# EAGLE design VUSB Protoboard (EAGLE 6.1)
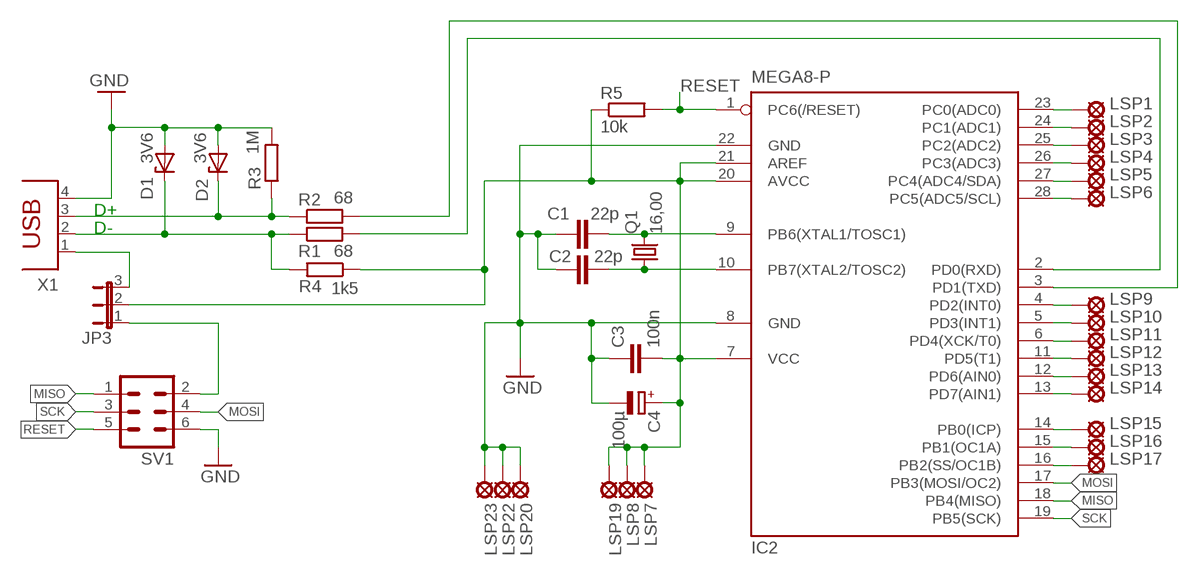
[diagram p0: schematic, sheet 1]

## Parts
C1  22p  C-EU025-025X050  [C025-025X050]
C2  22p  C-EU025-025X050  [C025-025X050]
C3  100n  C-EU025-025X050  [C025-025X050]
C4  100µ  CPOL-EUE2.5-6  [E2,5-6]
D1  3V6  ZENER-DIODEZD-7.5  [ZDIO-7.5]
D2  3V6  ZENER-DIODEZD-7.5  [ZDIO-7.5]
IC2  MEGA8-P  [DIL28-3]
JP3  JP2E  [JP2]
LSP1  LSP11  [LSP11]
LSP2  LSP11  [LSP11]
LSP3  LSP11  [LSP11]
LSP4  LSP11  [LSP11]
LSP5  LSP11  [LSP11]
LSP6  LSP11  [LSP11]
LSP7  LSP11  [LSP11]
LSP8  LSP11  [LSP11]
LSP9  LSP11  [LSP11]
LSP10  LSP11  [LSP11]
LSP11  LSP11  [LSP11]
LSP12  LSP11  [LSP11]
LSP13  LSP11  [LSP11]
LSP14  LSP11  [LSP11]
LSP15  LSP11  [LSP11]
LSP16  LSP11  [LSP11]
LSP17  LSP11  [LSP11]
LSP19  LSP11  [LSP11]
LSP20  LSP11  [LSP11]
LSP22  LSP11  [LSP11]
LSP23  LSP11  [LSP11]
Q1  16,00  CRYSTALHC49S  [HC49/S]
R1  68  R-EU_0207/10  [0207/10]
R2  68  R-EU_0207/10  [0207/10]
R3  1M  R-EU_0207/10  [0207/10]
R4  1k5  R-EU_0207/10  [0207/10]
R5  10k  R-EU_0207/10  [0207/10]
SV1  ML6  [ML6]
X1  PN61729  [PN61729]

## Nets
D+: D2.C R2.1 R3.1 X1.3
D-: D1.C R1.1 R4.2 X1.2
GND: C1.1 C2.1 C3.1 C4.- D1.A D2.A IC2.8(GND) IC2.22(GND) LSP20.MP LSP22.MP LSP23.MP R3.2 SV1.6 X1.4
ISPVCC: JP3.1 SV1.2
MISO: IC2.18(PB4(MISO)) SV1.1
MOSI: IC2.17(PB3(MOSI/OC2)) SV1.4
N$1: IC2.2(PD0(RXD)) R1.2
N$2: IC2.3(PD1(TXD)) R2.2
N$3: JP3.3 X1.1
N$4: IC2.16(PB2(SS/OC1B)) LSP17.MP
N$5: IC2.15(PB1(OC1A)) LSP16.MP
N$6: IC2.14(PB0(ICP)) LSP15.MP
N$7: IC2.13(PD7(AIN1)) LSP14.MP
N$8: IC2.12(PD6(AIN0)) LSP13.MP
N$9: C1.2 IC2.9(PB6(XTAL1/TOSC1)) Q1.2
N$10: C2.2 IC2.10(PB7(XTAL2/TOSC2)) Q1.1
N$11: IC2.11(PD5(T1)) LSP12.MP
N$12: IC2.6(PD4(XCK/T0)) LSP11.MP
N$13: IC2.5(PD3(INT1)) LSP10.MP
N$14: IC2.4(PD2(INT0)) LSP9.MP
N$15: IC2.23(PC0(ADC0)) LSP1.MP
N$16: IC2.24(PC1(ADC1)) LSP2.MP
N$17: IC2.25(PC2(ADC2)) LSP3.MP
N$18: IC2.26(PC3(ADC3)) LSP4.MP
N$19: IC2.27(PC4(ADC4/SDA)) LSP5.MP
N$20: IC2.28(PC5(ADC5/SCL)) LSP6.MP
RESET: IC2.1(PC6(/RESET)) R5.2 SV1.5
SCK: IC2.19(PB5(SCK)) SV1.3
VCC: C3.2 C4.+ IC2.7(VCC) IC2.20(AVCC) IC2.21(AREF) JP3.2 LSP7.MP LSP8.MP LSP19.MP R4.1 R5.1

## Notes on the sheet
- D+
- D-

## Library data of the parts
C1-C3 = resistor:C-EU: CAPACITOR, European symbol
C4 = resistor:CPOL-EU: POLARIZED CAPACITOR, European symbol
D1 D2 = diode:ZENER-DIODE: Z-Diode
IC2 = atmel:MEGA8-P: MICROCONTROLLER 8 Kbytes FLASH, 1 kbytes SRAM, 512 bytes EEPROM, USART, 4-channel 10 bit ADC, 2-channel 8 bit ADC Pin compatible with Atmega48, ATMega88, ATMega168 Source: avr.lbr; OC_FARNELL: unknown; OC_NEWARK: unknown
JP3 = jumper:JP2E: JUMPER
LSP1-LSP17 LSP19 LSP20 LSP22 LSP23 = solpad:LSP11: SOLDER PAD drill 1.1 mm
Q1 = crystal:CRYSTAL: CRYSTAL; OC_FARNELL: 1667008; OC_NEWARK: unknown
R1-R5 = resistor:R-EU_: RESISTOR, European symbol
SV1 = con-harting-ml:ML6: HARTING; OC_FARNELL: unknown; OC_NEWARK: unknown
X1 = con-berg:PN61729: BERG USB connector; OC_FARNELL: unknown; OC_NEWARK: unknown

## Board
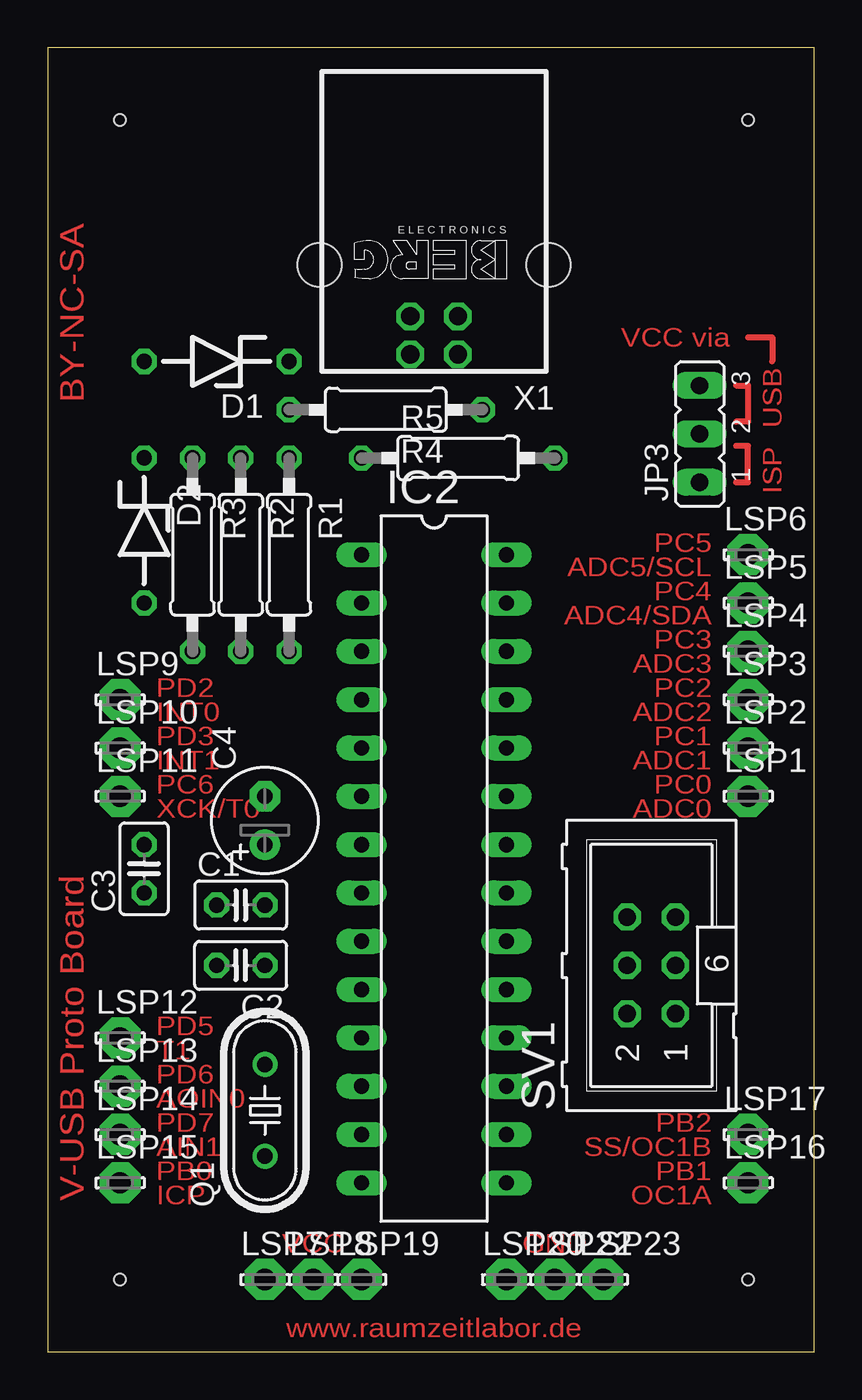
[diagram p1: board, top side]
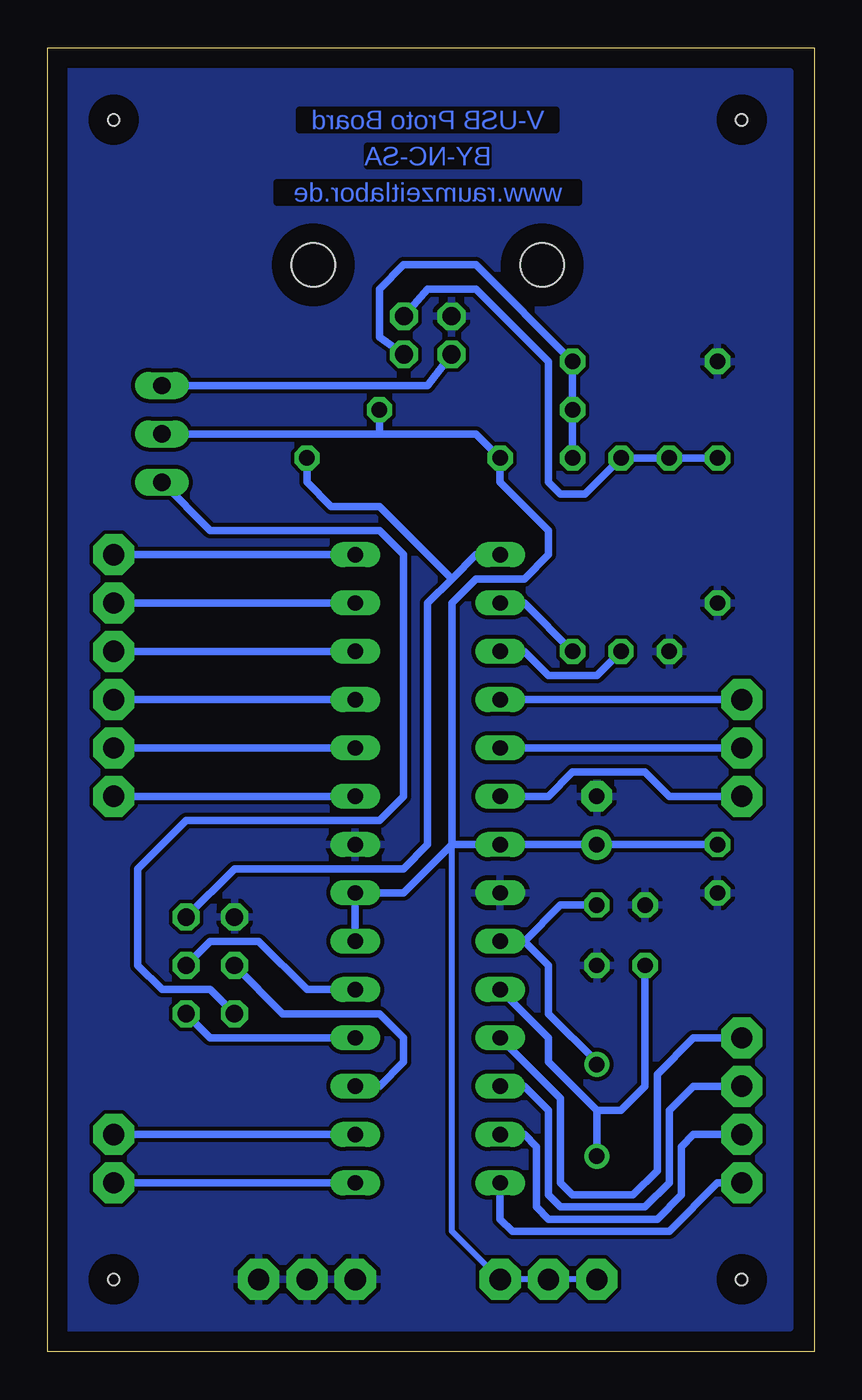
[diagram p2: board, bottom side, seen from below]

Size 40.31 x 68.57 mm. Coordinates in mm from the lower left corner, seen from the top.
Outline: 0,0 40.31,0 40.31,68.57 0,68.57 0,0
Copper layers (1*16): Top 0.035mm / dielectric 1.5mm / Bottom 0.035mm
Design rules: minimum track width 10mil, minimum drill 24mil, track to track 8mil, track to pad 8mil, pad to pad 8mil, via to via 8mil, smd to smd 8mil, copper to edge 40mil, drill to drill 8mil, minimum pad ring 10mil, minimum via ring 8mil, stop-mask expansion 4mil, vias tented up to drill 0mil, thermal gap 10mil
Holes 0.6 mm at 3.81,64.77 36.83,64.77 3.81,3.81 36.83,3.81

### Footprints (pad centres in the part's own frame; a part is rotated, then mirrored left to right if it is on the bottom)
C025-025X050 = drill 0.813 octagon: 1 -1.27,0; 2 1.27,0
E2,5-6 = drill 0.813 pad 1.6: + -1.27,0 | drill 0.813 pad 1.6 octagon: - 1.27,0
ZDIO-7.5 = drill 0.813 octagon: A 3.81,0; C -3.81,0
DIL28-3 = drill 0.813 long: 1 -16.51,-3.81; 2 -13.97,-3.81; 3 -11.43,-3.81; 4 -8.89,-3.81; 5 -6.35,-3.81; 6 -3.81,-3.81; 7 -1.27,-3.81; 8 1.27,-3.81; 9 3.81,-3.81; 10 6.35,-3.81; 11 8.89,-3.81; 12 11.43,-3.81; 13 13.97,-3.81; 14 16.51,-3.81; 15 16.51,3.81; 16 13.97,3.81; 17 11.43,3.81; 18 8.89,3.81; 19 6.35,3.81; 20 3.81,3.81; 21 1.27,3.81; 22 -1.27,3.81; 23 -3.81,3.81; 24 -6.35,3.81; 25 -8.89,3.81; 26 -11.43,3.81; 27 -13.97,3.81; 28 -16.51,3.81
JP2 = drill 0.914 long: 1 -2.54,0; 2 0,0; 3 2.54,0
LSP11 = drill 1.118 pad 2.159 octagon: MP 0,0
HC49/S = drill 0.813: 1 -2.413,0; 2 2.413,0
0207/10 = drill 0.813 octagon: 1 -5.08,0; 2 5.08,0
ML6 = drill 0.914 octagon: 1 -2.54,-1.27; 2 -2.54,1.27; 3 0,-1.27; 4 0,1.27; 5 2.54,-1.27; 6 2.54,1.27
PN61729 = drill 0.95 octagon: 1 1.25,4.71; 2 -1.25,4.71; 3 -1.25,2.71; 4 1.25,2.71 | hole 2.3: -6.02,0; 6.02,0

### Placement (x,y rotation side)
C1  10.16,23.49 0 top
C2  10.16,20.32 180 top
C3  5.08,25.4 90 top
C4  11.43,27.94 90 top
D1  8.89,52.07 180 top
D2  5.08,43.18 270 top
IC2  20.32,25.4 270 top
JP3  34.29,48.26 90 top
LSP1  36.83,29.21 0 top
LSP2  36.83,31.75 0 top
LSP3  36.83,34.29 0 top
LSP4  36.83,36.83 0 top
LSP5  36.83,39.37 0 top
LSP6  36.83,41.91 0 top
LSP7  11.43,3.81 0 top
LSP8  13.97,3.81 0 top
LSP9  3.81,34.29 0 top
LSP10  3.81,31.75 0 top
LSP11  3.81,29.21 0 top
LSP12  3.81,16.51 0 top
LSP13  3.81,13.97 0 top
LSP14  3.81,11.43 0 top
LSP15  3.81,8.89 0 top
LSP16  36.83,8.89 0 top
LSP17  36.83,11.43 0 top
LSP19  16.51,3.81 0 top
LSP20  24.13,3.81 0 top
LSP22  26.67,3.81 0 top
LSP23  29.21,3.81 0 top
Q1  11.43,12.7 90 top
R1  12.7,41.91 270 top
R2  10.16,41.91 270 top
R3  7.62,41.91 270 top
R4  17.78,49.53 180 top
R5  21.59,46.99 0 top
SV1  31.75,20.32 90 top
X1  20.32,57.15 180 top

### Tracks (layer width: path | path; a pad name or v marks a point on that pad's centre or on a via)
D+
  Bottom 0.406: D2.C R3.1 R2.1 12.06,45.09 13.34,45.09 13.97,45.72 13.97,52.07 17.78,55.88 20.32,55.88 X1.3
D-
  Bottom 0.406: R1.1 D1.C | R4.2 D1.C | X1.2 22.86,53.34 22.86,55.88 21.59,57.15 17.78,57.15 D1.C
GND
  pour Bottom: 1.27,67.31 39.37,67.31 39.37,1.27 1.27,1.27
ISPVCC
  Bottom 0.406: SV1.2 31.75,19.05 34.29,19.05 35.56,20.32 35.56,25.4 33.02,27.94 22.86,27.94 21.59,29.21 21.59,41.91 22.86,43.18 31.75,43.18 JP3.1
MISO
  Bottom 0.406: IC2.18 31.75,16.51 SV1.1
MOSI
  Bottom 0.406: IC2.17 22.86,13.97 21.59,15.24 21.59,16.51 22.86,17.78 27.94,17.78 SV1.4
N$1
  Bottom 0.406: R1.2 15.24,39.37 IC2.2
N$2
  Bottom 0.406: R2.2 11.43,35.56 13.97,35.56 15.24,36.83 IC2.3
N$3
  Bottom 0.406: JP3.3 20.32,50.8 X1.1
N$4
  Bottom 0.406: LSP17.MP IC2.16
N$5
  Bottom 0.406: IC2.15 LSP16.MP
N$6
  Bottom 0.406: LSP15.MP 5.08,8.89 7.62,6.35 15.88,6.35 16.51,6.98 IC2.14
N$7
  Bottom 0.406: IC2.13 15.24,11.43 14.61,10.8 14.61,7.62 13.97,6.98 8.26,6.98 6.98,8.25 6.98,10.8 6.35,11.43 LSP14.MP
N$8
  Bottom 0.406: IC2.12 15.24,13.97 13.97,12.7 13.97,8.25 13.34,7.62 8.89,7.62 7.62,8.89 7.62,12.7 6.35,13.97 LSP13.MP
N$9
  Bottom 0.406: Q1.2 11.43,15.24 13.97,17.78 13.97,20.32 15.24,21.59 | 15.24,21.59 IC2.9 | C1.2 13.34,23.49 15.24,21.59
N$10
  Bottom 0.406: Q1.1 11.43,12.7 | 11.43,12.7 13.97,15.24 13.97,16.51 IC2.10 | C2.2 8.89,13.97 10.16,12.7 11.43,12.7
N$11
  Bottom 0.406: LSP12.MP 6.35,16.51 8.26,14.61 8.26,9.52 9.52,8.25 12.7,8.25 13.34,8.89 13.34,13.34 IC2.11
N$12
  Bottom 0.406: IC2.6 13.97,29.21 12.7,30.48 8.89,30.48 7.62,29.21 LSP11.MP
N$13
  Bottom 0.406: LSP10.MP IC2.5
N$14
  Bottom 0.406: IC2.4 LSP9.MP
N$15
  Bottom 0.406: LSP1.MP IC2.23
N$16
  Bottom 0.406: IC2.24 LSP2.MP
N$17
  Bottom 0.406: LSP3.MP IC2.25
N$18
  Bottom 0.406: IC2.26 LSP4.MP
N$19
  Bottom 0.406: IC2.27 LSP5.MP
N$20
  Bottom 0.406: LSP6.MP IC2.28
N$21
  Top 0.305: 36.2,45.72 36.83,45.72 36.83,47.62 36.2,47.62
N$22
  Top 0.305: 36.2,50.8 36.83,50.8 36.83,48.9 36.2,48.9
N$23
  Top 0.305: 36.83,53.34 38.1,53.34 38.1,52.07
RESET
  Bottom 0.406: SV1.5 30.48,25.4 21.59,25.4 20.32,26.67 20.32,39.37 19.05,40.64 | IC2.1 17.78,41.91 19.05,40.64 | 19.05,40.64 22.86,44.45 25.4,44.45 26.67,45.72 R5.2
SCK
  Bottom 0.406: IC2.19 26.67,19.05 29.21,21.59 31.75,21.59 SV1.3
VCC
  Bottom 0.305: LSP7.MP LSP8.MP LSP19.MP 19.05,6.35 19.05,26.67
  Bottom 0.406: 19.05,26.67 IC2.7 C4.+ C3.2 | 19.05,26.67 21.59,24.13 IC2.21 IC2.20 | JP3.2 22.86,48.26 | 22.86,48.26 17.78,48.26 R5.1 16.51,45.72 13.97,43.18 13.97,41.91 15.24,40.64 17.78,40.64 19.05,39.37 19.05,26.67 | R4.1 22.86,48.26

### Text on the board
Top: BY-NC-SA | VCC via | USB | ISP | PC5 | ADC5/SCL | PC4 | ADC4/SDA | PC3 | ADC3 | PD2 | PC2 | INT0 | ADC2 | PD3 | PC1 | INT1 | ADC1 | PC6 | PC0 | XCK/T0 | ADC0 | PD5 | V-USB Proto Board | T1 | PD6 | AOIN0 | PD7 | PB2 | AIN1 | SS/OC1B | PB0 | PB1 | ICP | OC1A | VCC | GND | www.raumzeitlabor.de
Bottom: V-USB Proto Board | BY-NC-SA | www.raumzeitlabor.de